# EasyEDA Pro project gd32e230c8t6v2.eprj

# Schematic GD32E230C8T6V2

## Sheets
1 GD32: Create Date: 2023-12-13; Page Name: P1; Project Name: gd32e230c8t6v2; Schematic Name: GD32E230C8T6V2; Update Date: 2024-05-20; Company: 嘉立创EDA; Page Size: A4; Version: V1.0
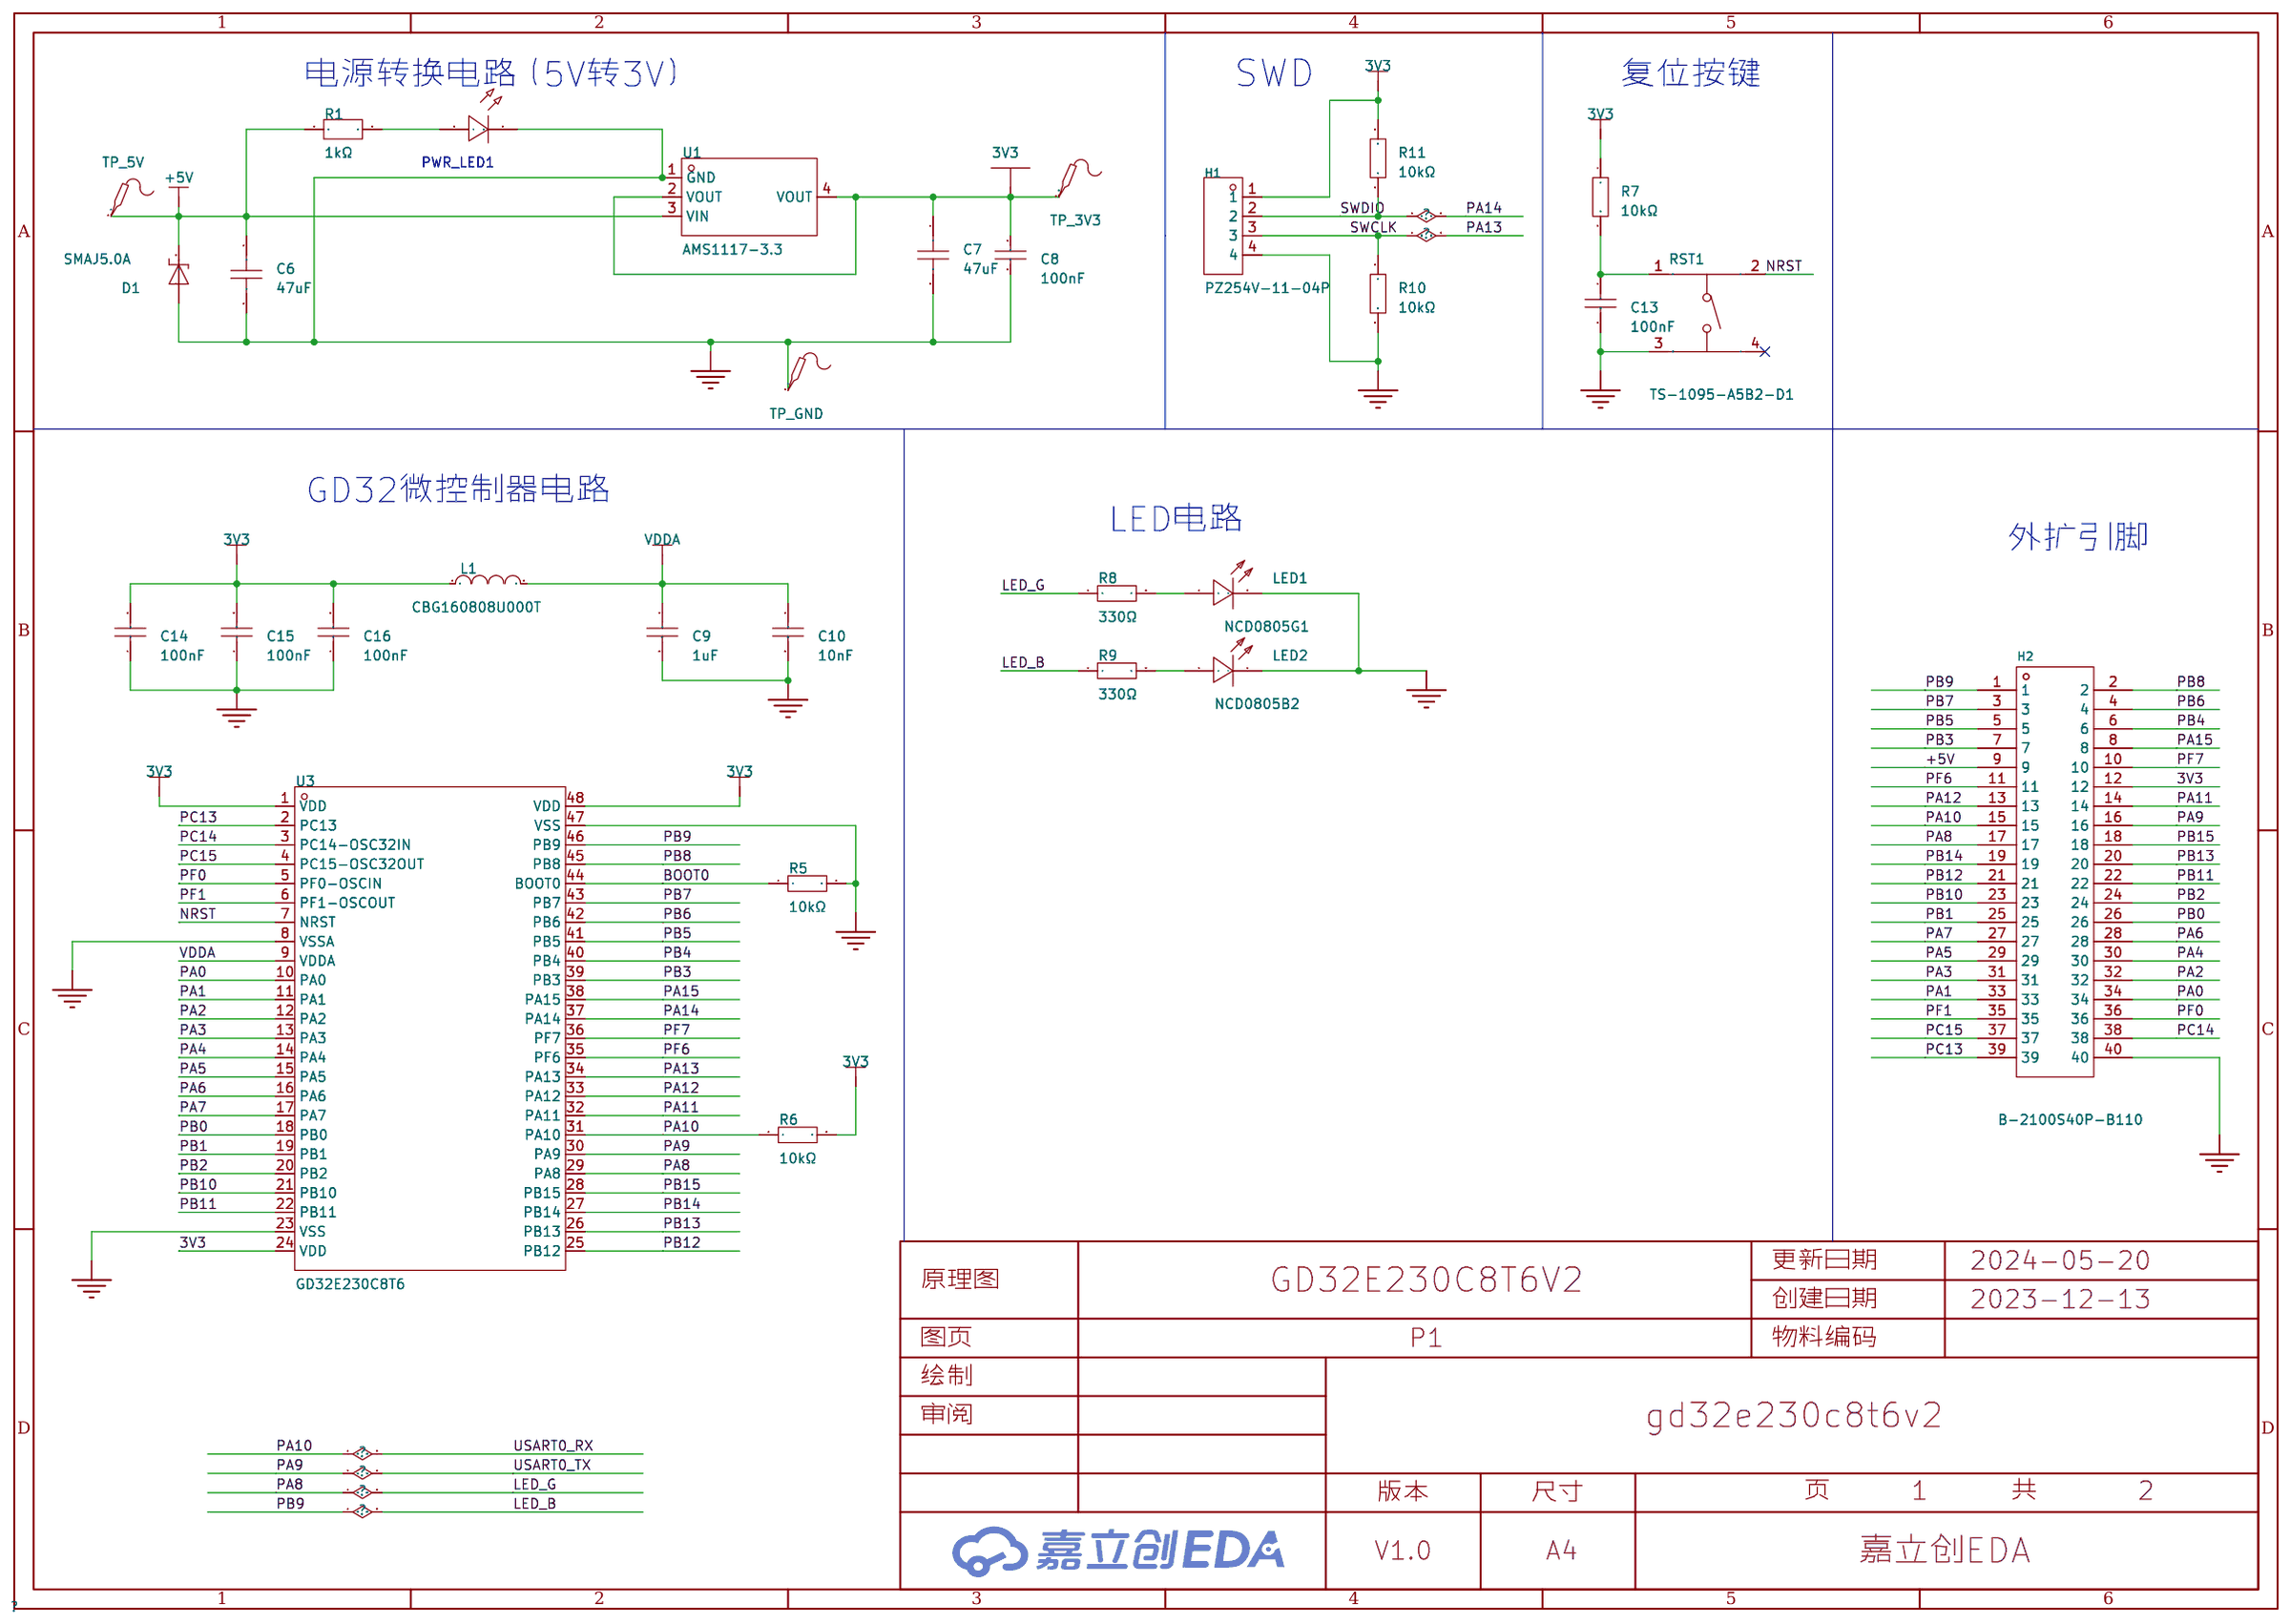
[diagram p0: GD32]
2 PY32: Create Date: 2024-06-04; Page Name: PY32; Update Date: 2024-06-04
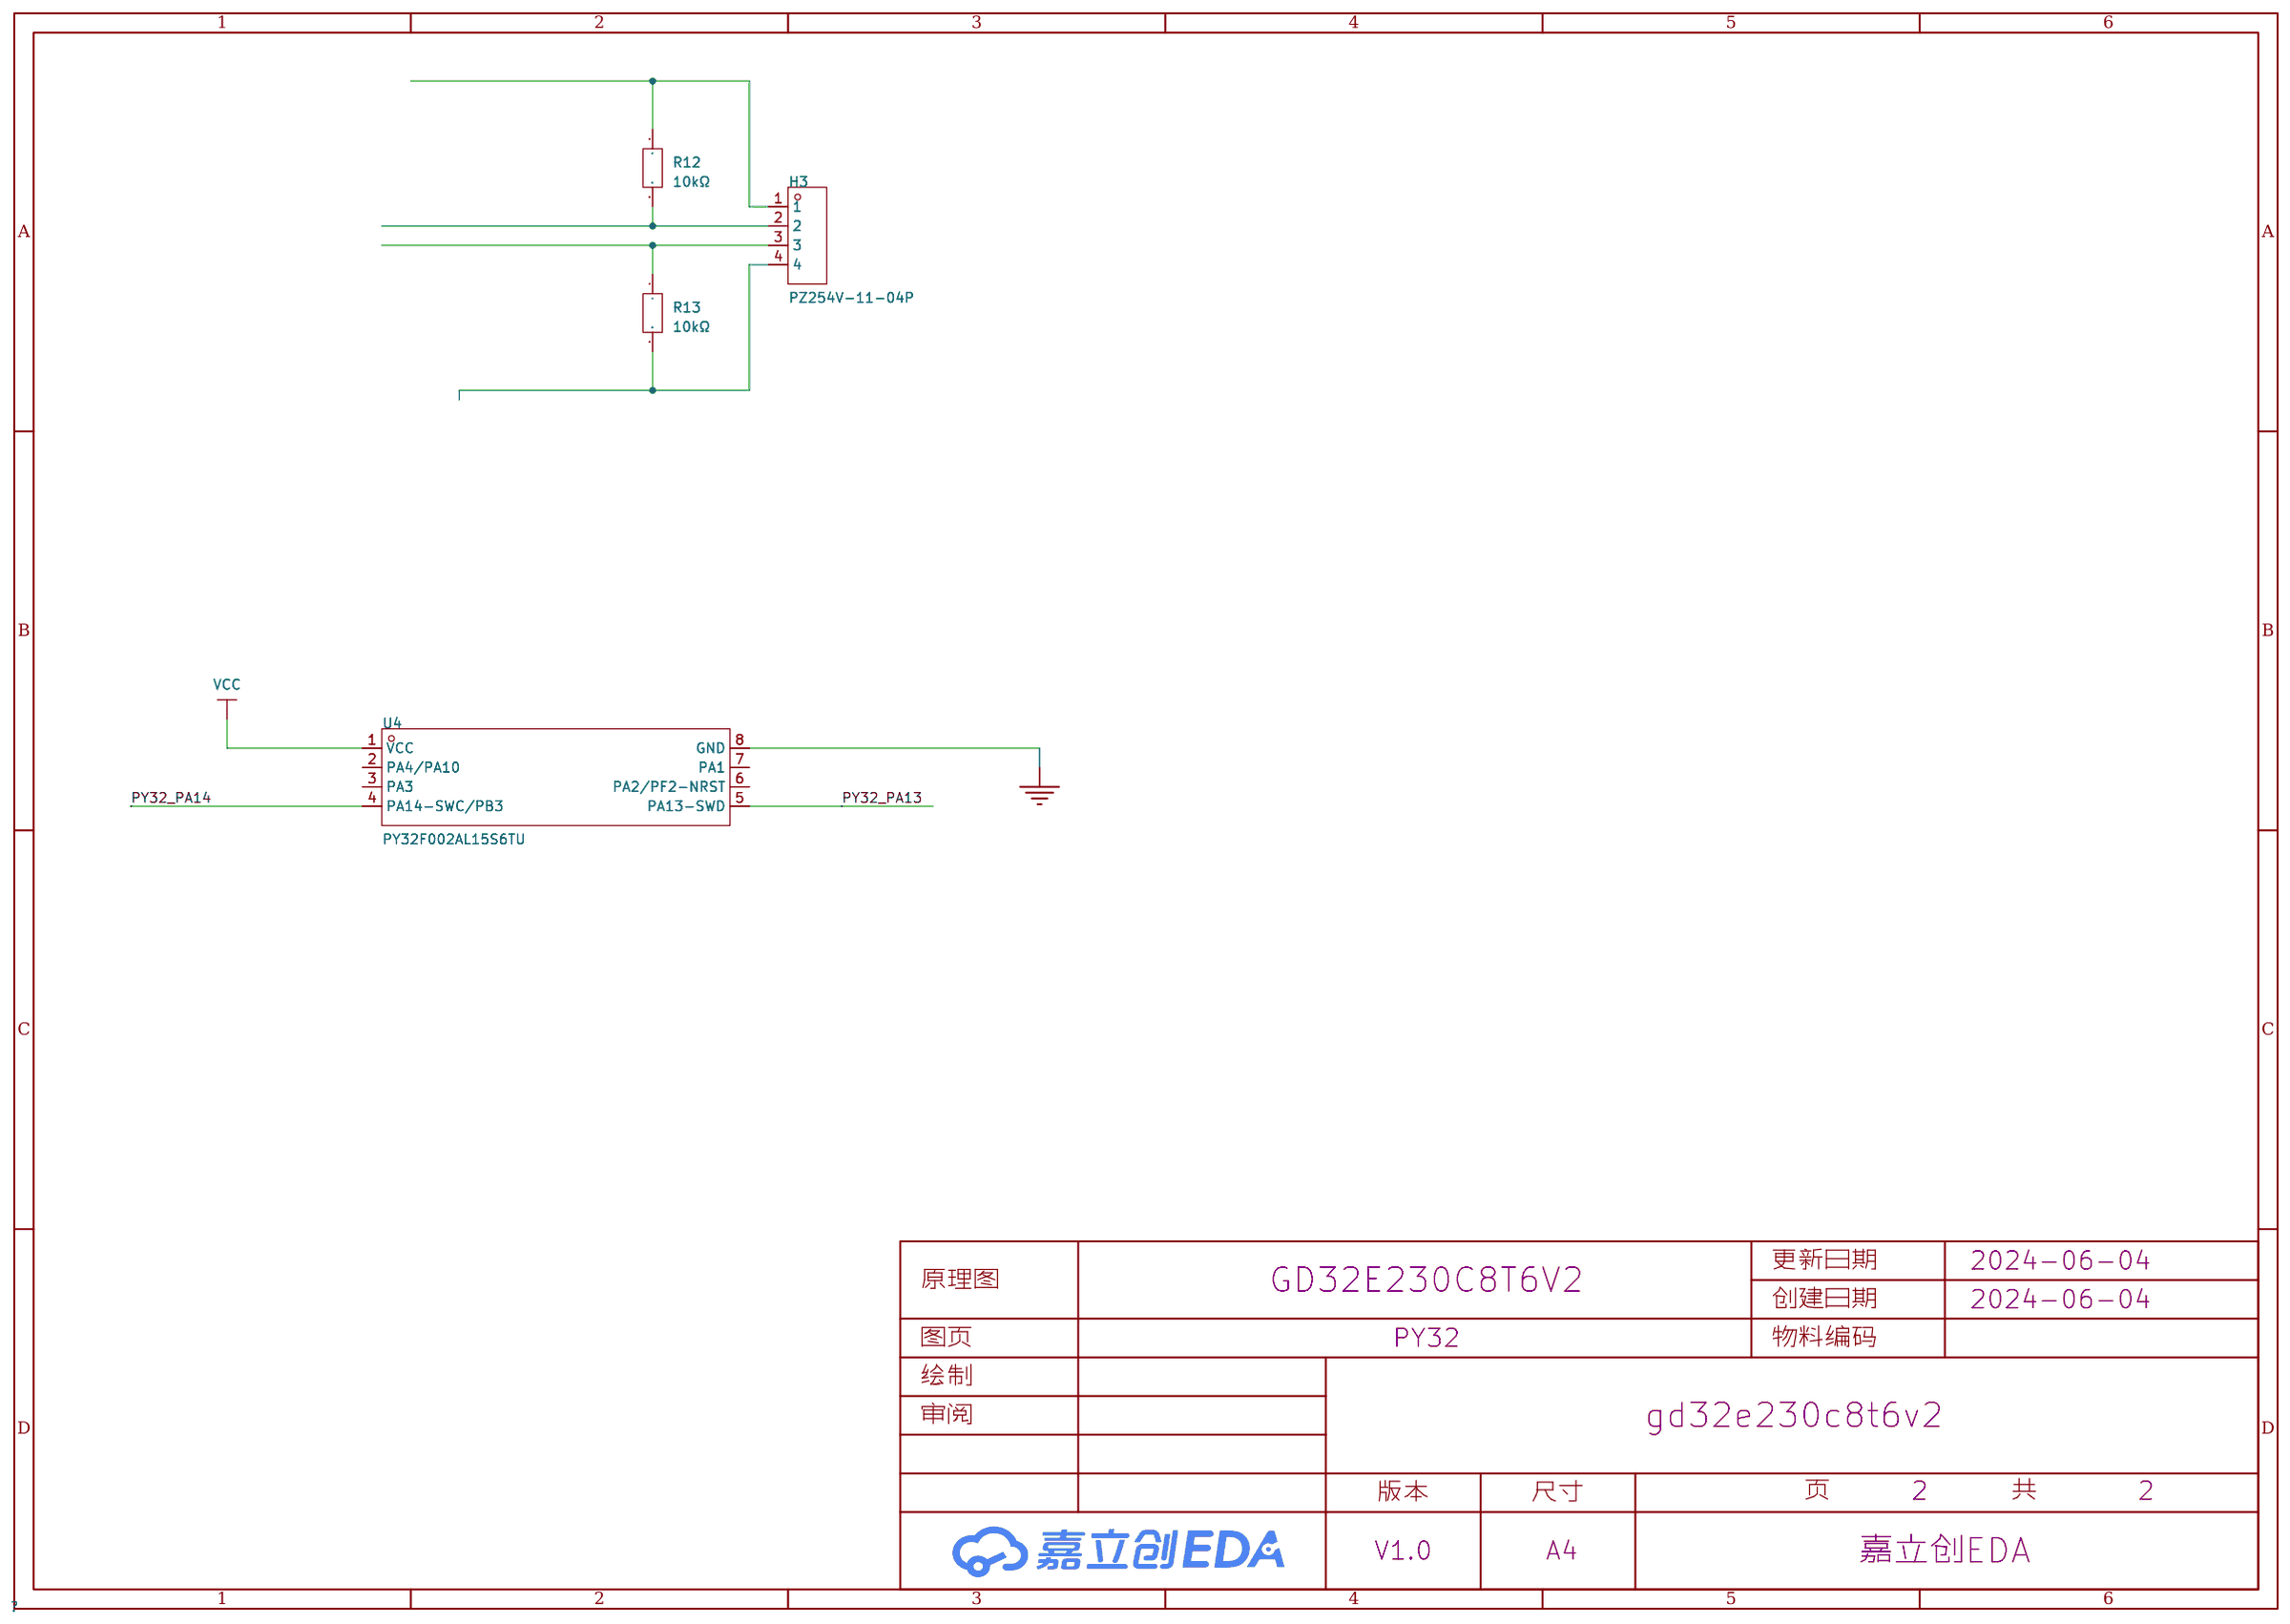
[diagram p1: PY32]

## Parts
sheet GD32
C6  47uF  [c1206]
C7  47uF  [c1206]
C8  100nF  [C1206]
C9  1uF  [C0603]
C10  10nF  [C0603]
C13  100nF  [C0603]
C14  100nF  [C0603]
C15  100nF  [C0603]
C16  100nF  [C0603]
D1  SMAJ5.0A  [SMA_L4.3-W2.6-LS5.2-FD]
H1  PZ254V-11-04P  [HDR-TH_4P-P2.54-V-M]
H2  B-2100S40P-B110  [HDR-TH_40P-P2.54-V-M-R2-C20-S2.54]
L1  CBG160808U000T  [L0603]
LED1  NCD0805G1  [LED0805-R-RD]
LED2  NCD0805B2  [LED0805-R-RD]
PWR_LED1  -  [LED_0805]
R1  1kΩ  [r0603]
R5  10kΩ  [R0603]
R6  10kΩ  [R0603]
R7  10kΩ  [R0603]
R8  330Ω  [R0603]
R9  330Ω  [R0603]
R10  10kΩ  [R0603]
R11  10kΩ  [R0603]
RST1  TS-1095-A5B2-D1  [SW-TH_4P-L6.0-W6.0-P4.50-LS6.5]
TP_3V3  -  [Test-Point-0.5mm]
TP_5V  -  [Test-Point-0.5mm]
TP_GND  -  [Test-Point-0.5mm]
U1  AMS1117-3.3  [SOT-223_L6.5-W3.5-P2.30-LS7.0-BR]
U3  GD32E230C8T6  [LQFP-48_L7.0-W7.0-P0.50-LS9.0-BL]
sheet PY32
H3  PZ254V-11-04P  [HDR-TH_4P-P2.54-V-M]
R12  10kΩ  [R0603]
R13  10kΩ  [R0603]
U4  PY32F002AL15S6TU  [SOP-8_L4.9-W3.9-P1.27-LS6.0-BL-1]

## Library data of the parts
C6 C7 = JMK325B7476KMHPR: 容值:47uF;精度:±10%;额定电压:6.3V;材质(温度系数):X7R;; LCSC Part Name: 47uF ±10% 6.3V; Supplier Part: C386026; Manufacturer: TAIYO YUDEN(太诱); Supplier Footprint: 1210; JLCPCB Part Class: Extended Part; Datasheet: https://atta.szlcsc.com/upload/public/pdf/source/20190827/C386026_5009711090E4AA535975339AD2C25863.pdf; Supplier: LCSC; Tolerance: ±10%; Voltage Rated: 6.3V; Temperature Coefficient: X7R
C8 = FN31X104K500PXG: 容值:100nF;精度:±10%;额定电压:50V;温度系数:X7R;; LCSC Part Name: 100nF ±10% 50V; Supplier Part: C464972; Manufacturer: PSA(信昌电陶); Supplier Footprint: 1206; JLCPCB Part Class: Extended Part; Datasheet: https://atta.szlcsc.com/upload/public/pdf/source/20191129/C464972_F56C30176D6B20CF6A8E48930D821D51.pdf; Supplier: LCSC; Tolerance: ±10%; Voltage Rated: 50V; Temperature Coefficient: X7R
C9 = CL10A105KB8NNNC: 容值:1uF;精度:±10%;额定电压:50V;材质(温度系数):X5R;; LCSC Part Name: 1uF ±10% 50V; Supplier Part: C15849; Manufacturer: SAMSUNG(三星); Supplier Footprint: 0603; JLCPCB Part Class: Basic Part; Datasheet: https://atta.szlcsc.com/upload/public/pdf/source/20160103/1457707679084.pdf; Supplier: LCSC; Tolerance: ±10%; Voltage Rated: 50V; Temperature Coefficient: X5R
C10 = CC0603KRX7R9BB103: 容值:10nF;精度:±10%;额定电压:50V;材质(温度系数):X7R;; LCSC Part Name: 10nF ±10% 50V; Supplier Part: C100042; Manufacturer: YAGEO(国巨); Supplier Footprint: 0603; JLCPCB Part Class: Extended Part; Datasheet: https://atta.szlcsc.com/upload/public/pdf/source/20180326/C100042_E8B0111D51DE3671A0A4A59FBCEFE81C.pdf; Supplier: LCSC; Tolerance: ±10%; Voltage Rated: 50V; Temperature Coefficient: X7R
C13-C16 = 0603B104K500NT: 容值:100nF;精度:±10%;额定电压:50V;材质(温度系数):X7R;; LCSC Part Name: 100nF ±10% 50V; Supplier Part: C30926; Manufacturer: FH(风华); Supplier Footprint: 0603; JLCPCB Part Class: 扩展库; Datasheet: https://atta.szlcsc.com/upload/public/pdf/source/20170923/C30926_1506149436298988724.pdf; Supplier: LCSC; Tolerance: ±10%; Voltage Rated: 50V; Temperature Coefficient: X7R
D1 = SMAJ5.0A: 极性:单向;反向截止电压(Vrwm):5V;击穿电压(最小值):6.4V;击穿电压(最大值):7V;反向漏电流(Ir):800μA;峰值脉冲电流(Ipp)@10/1000μs:43.5A;最大钳位电压:9.2V;峰值脉冲功率(Ppp)@10/1000μs:400W;; LCSC Part Name: 单向 5V 400W; Supplier Part: C473803; Manufacturer: Slkor(萨科微); Supplier Footprint: SMA; JLCPCB Part Class: Extended Part; Datasheet: https://atta.szlcsc.com/upload/public/pdf/source/20191224/C473803_5CBD384FC89E392B1C1B87C7884E179E.pdf; Supplier: LCSC; Polarity: 单向; Reverse Stand-Off Voltage (Vrwm): 5V; Breakdown Voltage (Min): 6.4V; Breakdown Voltage (Max): 7V; Reverse Leakage Current (Ir): 800μA; Peak Pulse Current (Ipp)@10/1000μs: 43.5A; Maximum Clamping Voltage: 9.2V; Peak Pulse Power Dissipation (Ppp)@10/1000μs: 400W
H1 H3 = PZ254V-11-04P: 排数:单排;总PIN位数:4P;间距:2.54mm;插针结构:1x4P;行距:-;安装类型:直插;圆针/方针:方针;额定电流:3A;额定电压:250V;配合针长度:6mm;塑高:2.5mm;端接针长度:3mm;触头材质:-;工作温度范围:-40℃~+105℃;颜色:黑色;; LCSC Part Name: 2.54mm 1x4P 直插 方针; Supplier Part: C2691448; Manufacturer: XFCN(兴飞); Supplier Footprint: 插件,P=2.54mm; JLCPCB Part Class: 扩展库; Datasheet: https://atta.szlcsc.com/upload/public/pdf/source/20200309/C492403_F9F19131791D08044AD4F84F8E751A34.pdf; Supplier: LCSC; Number of Rows: 单排; Number of Pins: 4P; Pitch: 2.54mm; Pin Structure: 1x4P; Mounting Type: 直插; Circluar Pins/Square Pins: 方针; Current Rating (Max): 3A; Voltage Rating (Max): 250V; Length of Mating Pin: 6mm; Insulation Height: 2.5mm; Length of End Connection Pin: 3mm; Operating Temperature Range: -40℃~+105℃; Color: 黑色
H2 = B-2100S40P-B110: 排数:双排;总PIN位数:40;间距:2.54mm;插针结构:2x20P;行距:2.54mm;安装类型:直插;圆针/方针:-;额定电流:-;额定电压:-;配合针长度:6mm;塑高:2.54mm;端接针长度:3mm;触头材质:黄铜;触头镀层:-;工作温度范围:-40℃~+105℃;颜色:黑色;; LCSC Part Name: 2.54mm 2x20P 直插; Supplier Part: C124383; Manufacturer: Ckmtw(灿科盟); Supplier Footprint: 直插,P=2.54mm; JLCPCB Part Class: 扩展库; Supplier: LCSC; Number of Rows: 双排; Number of Pins: 40; Pitch: 2.54mm; Pin Structure: 2x20P; Row Spacing: 2.54mm; Mounting Type: 直插; Length of Mating Pin: 6mm; Insulation Height: 2.54mm; Length of End Connection Pin: 3mm; Contact Material: 黄铜; Operating Temperature Range: -40℃~+105℃; Color: 黑色
L1 = CBG160808U000T: 标称阻抗@测试频率:0Ω@100MHz;直流电阻(RDC):100mΩ;; LCSC Part Name: 单路 0603磁珠 阻抗0Ω@100MHz; Supplier Part: C43163; Manufacturer: FH(风华); Supplier Footprint: 0603; JLCPCB Part Class: 扩展库; Datasheet: https://atta.szlcsc.com/upload/public/pdf/source/20190129/C361667_1614D407CC98D1D3CFBD9E1F7511C14D.pdf; Supplier: LCSC; Impedance @ Frequency: 0Ω@100MHz; DC Resistance: 100mΩ; Current Rating: 800mA; Circuits: 1
LED1 = NCD0805G1: 发光颜色:翠绿色;功率:72mW;透镜颜色:无色透明;主波长:525nm~537.5nm;发光强度:180mcd~400mcd;发光角度:130°;工作温度:-30℃~+85℃;; LCSC Part Name: 翠绿 0805翠绿  正贴; Supplier Part: C84260; Manufacturer: 国星光电; Supplier Footprint: 0805; JLCPCB Part Class: 扩展库; Datasheet: https://atta.szlcsc.com/upload/public/pdf/source/20200820/C84260_AFC7BF57C6FBA034D182BB8D10A67EFE.pdf; Supplier: LCSC; Emitted Color: 翠绿色; Forward Voltage (VF): 2.5V~3.6V; Forward Current: 5mA; Power Dissipation: 72mW; Lens Color: 无色透明; Dominant Wavelength: 525nm~537.5nm; Luminous Intensity: 180mcd~400mcd; Viewing Angle: 130°; Operating Temperature: -30℃~+85℃
LED2 = NCD0805B2: 发光颜色:蓝色;功率:72mW;透镜颜色:无色透明;主波长:468nm~478nm;发光强度:20mcd~55mcd;发光角度:130°;工作温度:-30℃~+85℃;; LCSC Part Name: 蓝灯 0805蓝灯   正贴; Supplier Part: C84259; Manufacturer: 国星光电; Supplier Footprint: 0805; JLCPCB Part Class: 扩展库; Datasheet: https://atta.szlcsc.com/upload/public/pdf/source/20200820/C84259_E5AC6865415989C4C2C2831134BA3A23.pdf; Supplier: LCSC; Emitted Color: 蓝色; Forward Voltage (VF): 2.5V~3.6V; Forward Current: 2mA; Power Dissipation: 72mW; Lens Color: 无色透明; Dominant Wavelength: 468nm~478nm; Luminous Intensity: 20mcd~55mcd; Viewing Angle: 130°; Operating Temperature: -30℃~+85℃
PWR_LED1 = LED_0805-B: Supplier Footprint: 0805
R1 = CRCW02011K00JNED: 电阻类型:厚膜电阻;阻值:1kΩ;精度:±5%;功率:50mW;温度系数:±200ppm/℃;; LCSC Part Name: 厚膜电阻 1kΩ ±5% 50mW; Supplier Part: C2073617; Manufacturer: VISHAY(威世); Supplier Footprint: 0201; JLCPCB Part Class: Extended Part; Datasheet: https://atta.szlcsc.com/upload/public/pdf/source/20210426/0D611F86AB3126A358A21AB7F04A2FCC.pdf; Supplier: LCSC; Type: 厚膜电阻; Tolerance: ±5%; Power(Watts): 50mW; Temperature Coefficient: ±200ppm/℃; Overload Voltage (Max): 30V; Operating Temperature Range: -55℃~+155℃
R5-R7 R10 R11 = 0603WAF1002T5E: 电阻类型:厚膜电阻;阻值:10kΩ;精度:±1%;功率:100mW;; LCSC Part Name: 厚膜电阻 10kΩ ±1% 100mW; Supplier Part: C25804; Manufacturer: UNI-ROYAL(厚声); Supplier Footprint: 0603; JLCPCB Part Class: 基础库; Datasheet: https://atta.szlcsc.com/upload/public/pdf/source/20200306/C422600_1E6D84923E4A46A82E41ADD87F860B5C.pdf; Supplier: LCSC; Type: 厚膜电阻; Tolerance: ±1%; Power(Watts): 100mW; Temperature Coefficient: ±100ppm/℃; Overload Voltage (Max): 75V; Operating Temperature Range: -55℃~+155℃
R8 R9 = 0603WAF3300T5E: 阻值:330Ω;精度:±1%;功率:100mW;温度系数:±100ppm/℃;电阻类型:厚膜电阻;; LCSC Part Name: 330Ω ±1% 100mW 厚膜电阻; Supplier Part: C23138; Manufacturer: UNI-ROYAL(厚声); Supplier Footprint: 0603; JLCPCB Part Class: 基础库; Datasheet: https://atta.szlcsc.com/upload/public/pdf/source/20200306/C422600_1E6D84923E4A46A82E41ADD87F860B5C.pdf; Supplier: LCSC; Tolerance: ±1%; Power(Watts): 100mW; Overload Voltage (Max): 75V; Temperature Coefficient: ±100ppm/℃; Type: 厚膜电阻; Operating Temperature Range: -55℃~+155℃
RST1 = TS-1095-A5B2-D1: 电路结构:单刀单掷;安装方式:直插;作用力:180gf@±30gf;机械寿命:-;带支架:否;; LCSC Part Name: 6*6*6mm 直插 轻触开关; Supplier Part: C782808; Manufacturer: Yuandi(元迪); Supplier Footprint: 插件; JLCPCB Part Class: 扩展库; Datasheet: https://atta.szlcsc.com/upload/public/pdf/source/20200908/C782804_D14F61DCCBE05C7EE913124CF28857B3.pdf; Supplier: LCSC; Circuit: 单刀单掷; Mounting Style: 直插; Actuator Style: 圆形按钮; Actuator/Cap Color: 黑色; Operating Force: 180gf@±30gf; Pin Style: PC引脚; Switch Length: 6mm; Switch Width: 6mm; Switch Height: 6mm; Strike Gundam: 否
TP_3V3 TP_5V TP_GND = Test-Point: Test Point 测试点
U1 = AMS1117-5.0_C6187: 输出类型:固定;输出极性:正;输出通道数:1;最大输入电压:15V;输出电压:5V;压差:1.3V@(1A);输出电流:1A;电源纹波抑制比(PRSS):68dB@(120Hz);; LCSC Part Name: Vin=15V Vout=5V 1A 68dB@(120Hz); Supplier Part: C6187; Manufacturer: 美国AMS; Supplier Footprint: SOT-223; JLCPCB Part Class: Basic Part; Datasheet: https://atta.szlcsc.com/upload/public/pdf/source/20120416/1457706470701.pdf; Supplier: LCSC; Output Type: 固定; Output Polarity: 正; Number of Outputs: 1; Maximum Input Voltage: 15V; Output Voltage: 5V; Dropout Voltage: 1.3V@(1A); Output Current: 1A; Power Supply Rejection Ratio (PRSS): 68dB@(120Hz)
U3 = GD32E230C8T6: CPU内核:ARM-M系列;CPU最大主频:72MHz;程序存储容量:64KB;程序存储器类型:FLASH;RAM总容量:8KB;GPIO端口数量:39;; LCSC Part Name: ARM-M系列 72MHz; Supplier Part: C380535; Manufacturer: GigaDevice(兆易创新); Supplier Footprint: LQFP-48(7x7); JLCPCB Part Class: 扩展库; Datasheet: https://atta.szlcsc.com/upload/public/pdf/source/20191028/C380535_2A3608A1B122F87D1E8A29B0B3E313D6.pdf; Supplier: LCSC; CPU Core: ARM-M系列; CPU Maximum Speed: 72MHz; Operating Voltage Range: 1.8V~3.6V; Program Storage Size: 64KB; Program Memory Type: FLASH; RAM Size: 8KB; GPIO Ports Number: 39; ADC (Bit): 12bit; PWM (Bit): 16bit; 16Bit Timer: 6; UART/USART: 2; I2C: 2; SPI: 2; Internal Comparator: 有; Peripheral/Function: 片载温度传感器；DMA；看门狗；LIN总线协议；PWM；IrDA；RTC实时时钟; Watchdog: 有; Real-Time Clock: 有; Infrared Data Association: 有; Direct Memory Access: 有; Internal Oscillator: 有; Operating Temperature Range: -40℃~+85℃
R12 R13 = FRC0603J103TS: 电阻类型:厚膜电阻;阻值:10kΩ;精度:±5%;功率:100mW;最大工作电压:75V;温度系数:±100ppm/℃;; LCSC Part Name: 10kΩ ±5% 100mW 厚膜电阻; Supplier Part: C2930027; Manufacturer: FOJAN(富捷); Supplier Footprint: 0603; JLCPCB Part Class: 扩展库; Datasheet: https://atta.szlcsc.com/upload/public/pdf/source/20211221/925EC7D7225764EE0046F22065062C87.pdf; Supplier: LCSC; Type: 厚膜电阻; Tolerance: ±5%; Power(Watts): 100mW; Overload Voltage (Max): 75V; Temperature Coefficient: ±100ppm/℃; Operating Temperature Range: -55℃~+155℃
U4 = PY32F002AL15S6TU: 程序存储容量:20KB;RAM总容量:3KB;工作电压范围:1.7V~5.5V;CPU最大主频:24MHz;程序存储器类型:FLASH;; LCSC Part Name: 32位微控制器 单片机 PY32F002AL15S6TU; Supplier Part: C5292060; Manufacturer: PUYA(普冉); Supplier Footprint: SOP-8; JLCPCB Part Class: 扩展库; Datasheet: https://atta.szlcsc.com/upload/public/pdf/source/20230327/672347329C675A87241B0153A51AEBC2.pdf; Supplier: LCSC; Program Storage Size: 20KB; RAM Size: 3KB; Operating Voltage Range: 1.7V~5.5V; CPU Maximum Speed: 24MHz; Program Memory Type: FLASH; ADC (Bit): 12bit

## Nets
3V3: C7.1 C8.1 C14.2 C15.2 C16.2 H1.1 H2.12 L1.1 R6.2 R7.1 R11.2 TP_3V3.1 U1.2(VOUT) U1.4(VOUT) U3.1(VDD) U3.24(VDD) U3.48(VDD)
+5V: C6.1 D1.2(K) H2.9 R1.1 TP_5V.1 U1.3(VIN)
GND: C6.2 C7.2 C8.2 C9.2 C10.2 C13.2 C14.1 C15.1 C16.1 D1.1(A) H1.4 H2.40 LED1.2(K) LED2.2(-) PWR_LED1.1(C) R5.2 R10.2 RST1.3 TP_GND.1 U1.1(GND) U3.8(VSSA) U3.23(VSS) U3.47(VSS) U4.8(GND)
VCC: U4.1(VCC)
VDDA: C9.1 C10.1 L1.2 U3.9(VDDA)
BOOT0: R5.1 U3.44(BOOT0)
LED_B: H2.1 R9.1 U3.46(PB9)
LED_G: H2.17 R8.1 U3.29(PA8)
NRST: RST1.2 U3.7(NRST)
PA0: H2.34 U3.10(PA0)
PA1: H2.33 U3.11(PA1)
PA2: H2.32 U3.12(PA2)
PA3: H2.31 U3.13(PA3)
PA4: H2.30 U3.14(PA4)
PA5: H2.29 U3.15(PA5)
PA6: H2.28 U3.16(PA6)
PA7: H2.27 U3.17(PA7)
PA9: H2.16 U3.30(PA9)
PA10: H2.15 R6.1 U3.31(PA10)
PA11: H2.14 U3.32(PA11)
PA12: H2.13 U3.33(PA12)
PA13: H1.3 R10.1 U3.34(PA13)
PA14: H1.2 R11.1 U3.37(PA14)
PA15: H2.8 U3.38(PA15)
PB0: H2.26 U3.18(PB0)
PB1: H2.25 U3.19(PB1)
PB2: H2.24 U3.20(PB2)
PB3: H2.7 U3.39(PB3)
PB4: H2.6 U3.40(PB4)
PB5: H2.5 U3.41(PB5)
PB6: H2.4 U3.42(PB6)
PB7: H2.3 U3.43(PB7)
PB8: H2.2 U3.45(PB8)
PB10: H2.23 U3.21(PB10)
PB11: H2.22 U3.22(PB11)
PB12: H2.21 U3.25(PB12)
PB13: H2.20 U3.26(PB13)
PB14: H2.19 U3.27(PB14)
PB15: H2.18 U3.28(PB15)
PC13: H2.39 U3.2(PC13)
PC14: H2.38 U3.3(PC14-OSC32IN)
PC15: H2.37 U3.4(PC15-OSC32OUT)
PF0: H2.36 U3.5(PF0-OSCIN)
PF1: H2.35 U3.6(PF1-OSCOUT)
PF6: H2.11 U3.35(PF6)
PF7: H2.10 U3.36(PF7)
PY32_PA13: U4.5(PA13-SWD)
PY32_PA14: U4.4(PA14-SWC/PB3)
Net-(C13-1): C13.1 R7.2 RST1.1
Net-(H3-1): H3.1 R12.1
Net-(H3-2): H3.2 R12.2
Net-(H3-3): H3.3 R13.1
Net-(H3-4): H3.4 R13.2
Net-(LED1-1): LED1.1(A) R8.2
Net-(LED2-1): LED2.1(+) R9.2
Net-(PWR_LED1-2): PWR_LED1.2(A) R1.2

Not connected (* = marked no-connect by the designer): RST1 4*; U4 2(PA4/PA10) 3(PA3) 6(PA2/PF2-NRST) 7(PA1)

## Notes on the sheets
sheet 1
- 电源转换电路（5V转3V）
- SWD
- 复位按键
- GD32微控制器电路
- LED电路
- 外扩引脚
